# EAGLE design Copy of untitled (EAGLE 7.2.0)
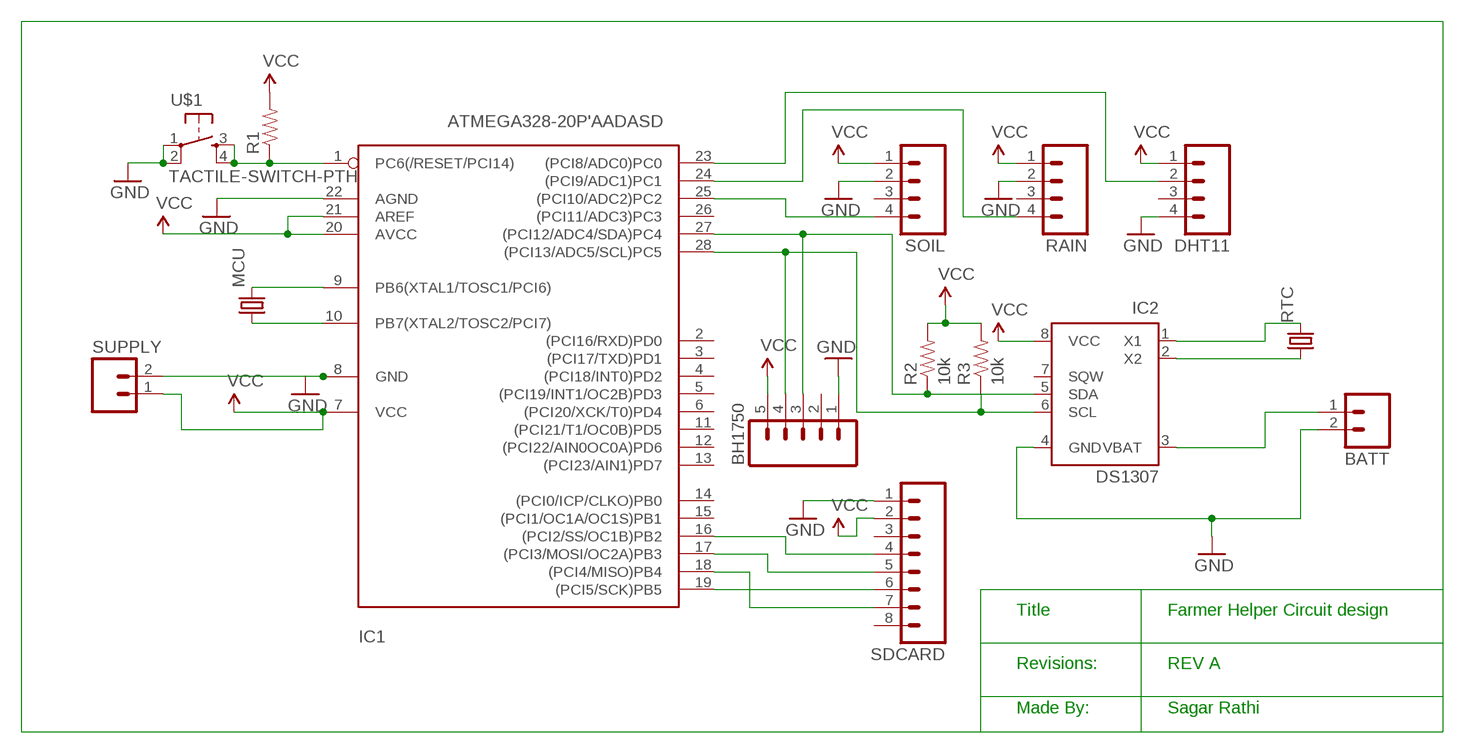
[diagram p0: schematic, sheet 1]

## Parts
BATT  M02PTH3  [1X02_LONGPADS]
BH1750  M05LOCK_LONGPADS  [1X05_LOCK_LONGPADS]
DHT11  M04LONGPADS  [1X04_LONGPADS]
IC1  ATMEGA328-20P'AADASD  [DIL28-3]
IC2  DS1307  [DIP-8]
MCU  CRYSTALTC38H  [TC38H]
R1  RESISTORAXIAL-0.3  [AXIAL-0.3]
R2  10k  10KOHM-1/4W-1%(PTH)HORIZ  [AXIAL-0.3]
R3  10k  10KOHM-1/4W-1%(PTH)HORIZ  [AXIAL-0.3]
RAIN  M04LONGPADS  [1X04_LONGPADS]
RTC  CRYSTALTC26H_EZ  [TC26HEZ]
SDCARD  M08LONGPADS  [1X08_LONGPADS]
SOIL  M04LONGPADS  [1X04_LONGPADS]
SUPPLY  M02PTH3  [1X02_LONGPADS]
U$1  TACTILE-SWITCH-PTH  [TAC-SWITCH-PTH]

## Nets
GND: BATT.2 BH1750.1 DHT11.4 IC1.8(GND) IC1.22(AGND) IC2.4(GND) RAIN.2 SDCARD.1 SOIL.2 SUPPLY.2 U$1.1 U$1.2
N$1: IC1.1(PC6(/RESET/PCI14)) R1.P$1 U$1.3 U$1.4
N$2: IC1.9(PB6(XTAL1/TOSC1/PCI6)) MCU.2
N$3: IC1.10(PB7(XTAL2/TOSC2/PCI7)) MCU.1
N$4: IC1.25((PCI10/ADC2)PC2) SOIL.4
N$5: IC1.24((PCI9/ADC1)PC1) RAIN.4
N$6: DHT11.2 IC1.23((PCI8/ADC0)PC0)
N$7: IC2.1(X1) RTC.2
N$8: IC2.2(X2) RTC.1
N$10: BATT.1 IC2.3(VBAT)
N$11: BH1750.4 IC1.28((PCI13/ADC5/SCL)PC5) IC2.6(SCL) R3.P$1
N$12: BH1750.3 IC1.27((PCI12/ADC4/SDA)PC4) IC2.5(SDA) R2.P$1
N$15: IC1.16((PCI2/SS/OC1B)PB2) SDCARD.4
N$16: IC1.17((PCI3/MOSI/OC2A)PB3) SDCARD.5
N$17: IC1.19((PCI5/SCK)PB5) SDCARD.6
N$18: IC1.18((PCI4/MISO)PB4) SDCARD.7
VCC: BH1750.5 DHT11.1 IC1.7(VCC) IC1.20(AVCC) IC1.21(AREF) IC2.8(VCC) R1.P$2 R2.P$2 R3.P$2 RAIN.1 SDCARD.2 SOIL.1 SUPPLY.1
Unconnected: BH1750.2 DHT11.3 IC1.2((PCI16/RXD)PD0) IC1.3((PCI17/TXD)PD1) IC1.4((PCI18/INT0)PD2) IC1.5((PCI19/INT1/OC2B)PD3) IC1.6((PCI20/XCK/T0)PD4) IC1.11((PCI21/T1/OC0B)PD5) IC1.12((PCI22/AIN0OC0A)PD6) IC1.13((PCI23/AIN1)PD7) IC1.14((PCI0/ICP/CLKO)PB0) IC1.15((PCI1/OC1A/OC1S)PB1) IC1.26((PCI11/ADC3)PC3) IC2.7(SQW) RAIN.3 SDCARD.3 SDCARD.8 SOIL.3

## Notes on the sheet
- Title | Farmer Helper Circuit design
- Revisions: | REV A
- Made By: | Sagar Rathi

## Library data of the parts
BATT SUPPLY = SparkFun-Connectors:M02: Standard 2-pin 0.1" header. Use with - straight break away headers ( PRT-00116) - right angle break away headers (PRT-00553) - swiss pins (PRT-00743) - machine pins (PRT-00117) - female headers (PRT-00115) Molex polarized connector foot print use with: PRT-08233 with associated crimp pins and housings. 2.54_SCREWTERM for use with PRT-10571. 3.5mm Screw Terminal footprints for PRT-08084 5mm Screw Terminal footprints for use with PRT-08432
BH1750 = SparkFun-Connectors:M05: Header 5 Standard 5-pin 0.1" header. Use with straight break away headers (SKU : PRT-00116), right angle break away headers (PRT-00553), swiss pins (PRT-00743), machine pins (PRT-00117), and female headers (PRT-00115). Molex polarized connector foot print use with SKU : PRT-08230 with associated crimp pins and housings.
DHT11 RAIN SOIL = SparkFun-Connectors:M04: Header 4 Standard 4-pin 0.1" header. Use with straight break away headers (SKU : PRT-00116), right angle break away headers (PRT-00553), swiss pins (PRT-00743), machine pins (PRT-00117), and female headers (PRT-00115). Molex polarized connector foot print use with SKU : PRT-08231 with associated crimp pins and housings. 1MM SMD Version SKU: PRT-10208
IC1 = atmega328_modi:ATMEGA328*P: MICROCONTROLLER 32 kBytes FLASH 2 kBytes SRAM 1 kBytes EEPROM USART 8-channel 10 bit ADC
IC2 = DS1307:DS1307: DS1307 - 64×8, Serial, I2C Real Time Clock
MCU RTC = SparkFun-FreqCtrl:CRYSTAL: Various standard crystals. Proven footprints.
R1 = SparkFun-Resistors:RESISTOR: Resistor Basic schematic elements and footprints for 0603, 1206, and PTH resistors.
R2 R3 = SparkFun-Resistors:10KOHM-1/4W-1%(PTH): RES-12183; PROD_ID: RES-12183
SDCARD = SparkFun-Connectors:M08: Header 8 Standard 8-pin 0.1" header. Use with straight break away headers (SKU : PRT-00116), right angle break away headers (PRT-00553), swiss pins (PRT-00743), machine pins (PRT-00117), and female headers (PRT-00115).
U$1 = GeekAmmo:TACTILE-SWITCH: Tactile Switch 4 Pins, SPST NO

## Board
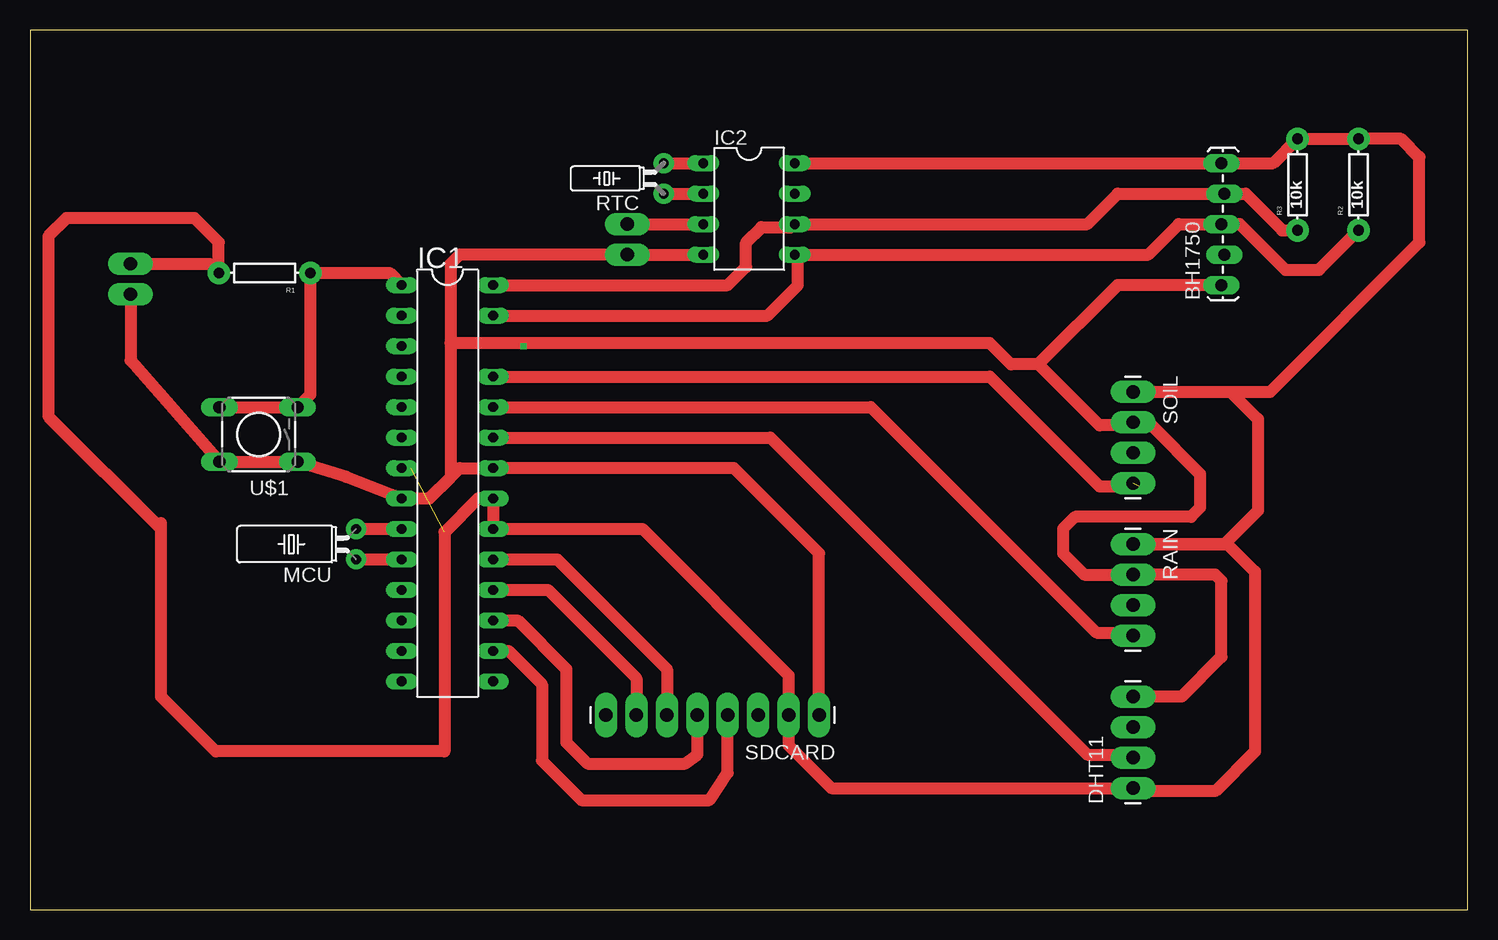
[diagram p1: board, top side]

Size 119.87 x 73.33 mm. Coordinates in mm from the lower left corner, seen from the top.
Outline: 0,0 119.87,0 119.87,73.33 0,73.33 0,0
Copper layers (1*16): Top 0.035mm / dielectric 1.5mm / Bottom 0.035mm
Design rules "default *": minimum track width 20mil, minimum drill 24mil, track to track 8mil, track to pad 8mil, pad to pad 8mil, via to via 8mil, smd to smd 8mil, copper to edge 40mil, drill to drill 8mil, minimum pad ring 10mil, minimum via ring 8mil, stop-mask expansion 4mil, vias tented up to drill 0mil, thermal gap 10mil

### Footprints (pad centres in the part's own frame; a part is rotated, then mirrored left to right if it is on the bottom)
1X02_LONGPADS = drill 1.118 pad 1.88 long: 1 0,0; 2 2.54,0
1X05_LOCK_LONGPADS = drill 1.016 long: 1 0,0; 2 2.54,-0.254; 3 5.08,0; 4 7.62,-0.254; 5 10.16,0
1X04_LONGPADS = drill 1.118 pad 1.88 long: 1 0,0; 2 2.54,0; 3 5.08,0; 4 7.62,0
DIL28-3 = drill 0.813 long: 1 -16.51,-3.81; 2 -13.97,-3.81; 3 -11.43,-3.81; 4 -8.89,-3.81; 5 -6.35,-3.81; 6 -3.81,-3.81; 7 -1.27,-3.81; 8 1.27,-3.81; 9 3.81,-3.81; 10 6.35,-3.81; 11 8.89,-3.81; 12 11.43,-3.81; 13 13.97,-3.81; 14 16.51,-3.81; 15 16.51,3.81; 16 13.97,3.81; 17 11.43,3.81; 18 8.89,3.81; 19 6.35,3.81; 20 3.81,3.81; 21 1.27,3.81; 22 -1.27,3.81; 23 -3.81,3.81; 24 -6.35,3.81; 25 -8.89,3.81; 27 -13.97,3.81; 28 -16.51,3.81 | drill 0 pad 0 square: 26 -11.43,6.35
DIP-8 = drill 0.813 long: 1 -3.81,-3.81; 2 -1.27,-3.81; 3 1.27,-3.81; 4 3.81,-3.81; 5 3.81,3.81; 6 1.27,3.81; 7 -1.27,3.81; 8 -3.81,3.81
TC38H = drill 0.813 pad 1.676: 1 -1.27,0; 2 1.27,0
AXIAL-0.3 = drill 0.9 pad 1.88: P$1 -3.81,0; P$2 3.81,0
TC26HEZ = drill 0.813 pad 1.676: 1 -1.27,0; 2 1.27,0
1X08_LONGPADS = drill 1.118 pad 1.88 long: 1 0,0; 2 2.54,0; 3 5.08,0; 4 7.62,0; 5 10.16,0; 6 12.7,0; 7 15.24,0; 8 17.78,0
TAC-SWITCH-PTH = drill 1.016 pad 1.524 long: 1 -3.251,2.261; 2 3.251,2.261; 3 -3.251,-2.261; 4 3.251,-2.261

### Placement (x,y rotation side)
BATT  49.78,57.15 270 top
BH1750  99.31,52.07 90 top
DHT11  91.95,10.16 90 top
IC1  34.8,35.56 270 top
IC2  59.94,58.42 270 top
MCU  27.18,30.48 90 top
R1  19.56,53.09 180 top
R2  110.74,60.45 90 top
R3  105.66,60.45 90 top
RAIN  91.95,30.48 270 top
RTC  52.83,60.96 90 top
SDCARD  65.79,16.26 180 top
SOIL  91.95,43.18 270 top
SUPPLY  8.38,53.85 270 top
U$1  19.05,39.62 180 top

### Tracks (layer width: path | path; a pad name or v marks a point on that pad's centre or on a via)
GND
  Top 1.016: 92.2,40.39 SOIL.2 | 92.2,40.39 93.47,40.39 97.54,36.32 97.54,33.53 96.77,32.77 87.12,32.77 86.11,31.75 86.11,29.72 87.88,27.94 RAIN.2 98.81,27.94 99.31,27.43 99.31,21.08 96.01,17.78 DHT11.4 | SDCARD.1 65.79,29.72 58.67,36.83 IC1.22 35.81,36.83 35.05,36.07 | 35.05,36.07 33.27,34.29 IC1.8 26.39,36.09 U$1.1 U$1.2 8.38,45.8 SUPPLY.2 | IC2.4 BATT.2 35.81,54.61 35.05,53.85 35.05,47.24 | 35.05,47.24 35.05,36.07 | 92.2,40.39 89.15,40.39 84.07,45.47 | BH1750.1 90.68,52.07 84.07,45.47 | 84.07,45.47 81.79,45.47 80.01,47.24 35.05,47.24
N$1
  Top 1.016: U$1.4 U$1.3 23.37,42.95 R1.P$1 29.97,53.09 IC1.1
N$2
  Top 1.016: MCU.2 IC1.9
N$3
  Top 1.016: MCU.1 IC1.10
N$4  (1 unrouted)
  Top 1.016: IC1.25 80.01,44.45 89.15,35.31 92.46,35.31
N$5
  Top 1.016: IC1.24 70.1,41.91 88.9,23.11 91.69,23.11 RAIN.4
N$6
  Top 1.016: IC1.23 61.72,39.37 88.14,12.95 91.69,12.95 DHT11.2
N$7
  Top 1.016: RTC.2 IC2.1
N$8
  Top 1.016: RTC.1 IC2.2
N$10
  Top 1.016: BATT.1 IC2.3
N$11
  Top 1.016: IC1.28 58.17,52.07 59.69,53.59 59.69,55.63 60.96,56.9 63.5,56.9 IC2.6 88.14,57.15 90.68,59.69 BH1750.4 101.35,59.69 104.39,56.64 R3.P$1
N$12
  Top 1.016: 110.49,56.64 R2.P$1 107.44,53.34 104.65,53.34 100.84,57.15 BH1750.3 95.76,57.15 93.22,54.61 IC2.5 64.01,54.36 64.01,52.07 61.47,49.53 IC1.27
N$15
  Top 1.016: IC1.16 39.88,21.59 42.67,18.8 42.67,12.45 45.97,9.14 56.64,9.14 58.17,11.43 SDCARD.4
N$16
  Top 1.016: IC1.17 40.64,24.13 44.7,20.07 44.7,13.97 46.48,12.19 54.61,12.19 55.63,12.95 SDCARD.5
N$17
  Top 1.016: IC1.19 43.94,29.21 53.09,20.07 SDCARD.6
N$18
  Top 1.016: IC1.18 43.18,26.67 50.55,19.3 SDCARD.7
VCC  (1 unrouted)
  Top 1.016: IC2.8 BH1750.5 103.63,62.23 R3.P$2 R2.P$2 114.3,64.26 115.82,62.74 115.82,55.63 103.38,43.18 100.08,43.18 | SOIL.1 100.08,43.18 | 100.08,43.18 102.36,40.89 102.36,33.27 99.57,30.48 RAIN.1 99.82,30.48 102.11,28.19 102.11,13.21 98.81,9.91 92.2,9.91 DHT11.1 66.8,10.16 63.25,13.72 SDCARD.2 63.25,19.56 51.05,31.75 IC1.20 IC1.21 37.34,34.29 34.54,31.5 34.54,13.21 15.49,13.21 10.92,17.78 10.92,31.75 | 10.92,31.75 10.92,32.26 | SUPPLY.1 14.99,53.85 R1.P$2 15.75,55.63 13.72,57.66 3.05,57.66 1.52,56.13 1.52,41.15 10.92,31.75 | IC1.7 31.75,36.83